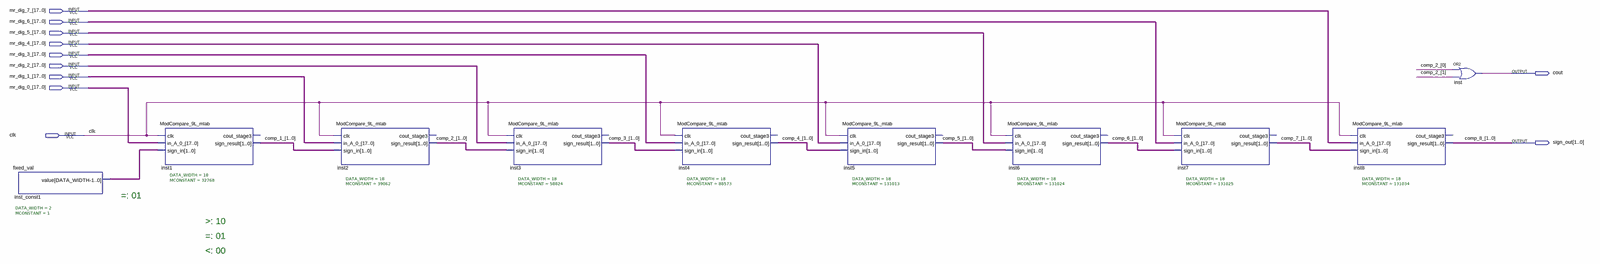
[diagram p0: schematic sheet, whole]
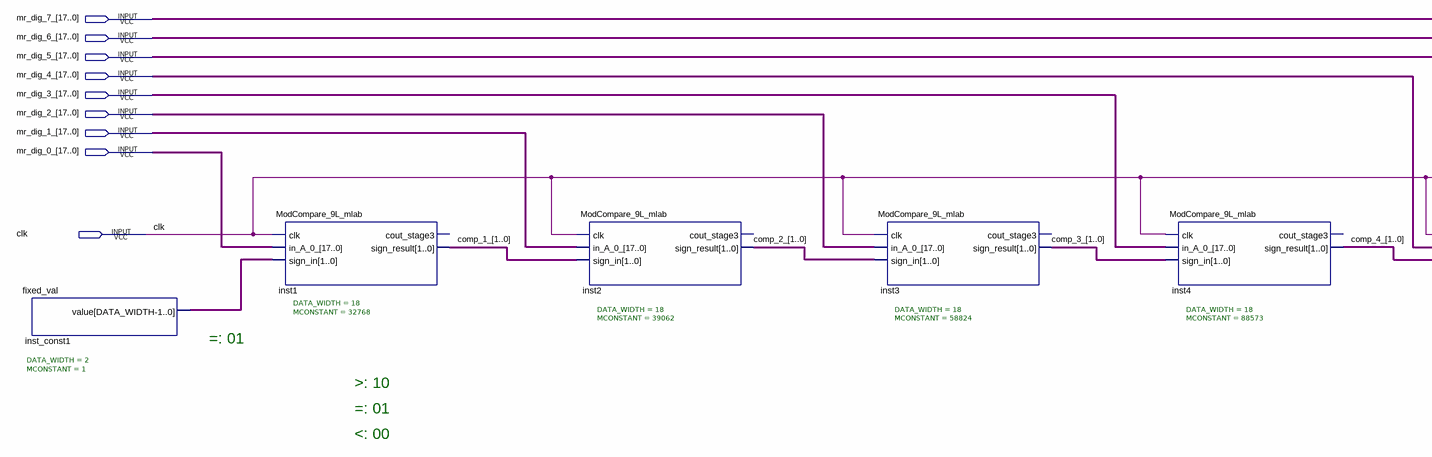
[diagram p1: schematic sheet, left part]
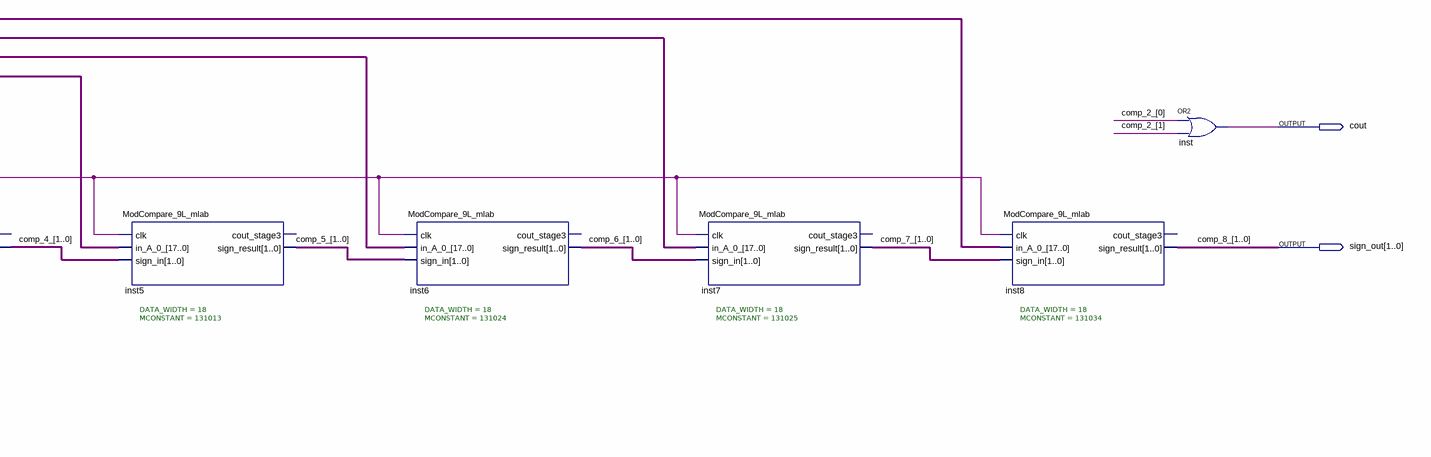
[diagram p2: schematic sheet, right part]
// Quartus schematic Compare_pipe.bdf as structural Verilog: 10 symbols, 11 pins
module Compare_pipe (
  input  [17:0] mr_dig_7_,
  input  [17:0] mr_dig_6_,
  input  [17:0] mr_dig_5_,
  input  [17:0] mr_dig_4_,
  input  [17:0] mr_dig_3_,
  input  [17:0] mr_dig_2_,
  input  [17:0] mr_dig_1_,
  input  [17:0] mr_dig_0_,
  input  clk,
  output cout,
  output [1:0] sign_out
);

  wire [1:0] comp_1_, comp_2_, comp_3_, comp_4_, comp_5_, comp_6_, comp_7_, inst_const1_value;

  fixed_val #(.DATA_WIDTH(2), .MCONSTANT(1)) inst_const1 (.value(inst_const1_value));
  ModCompare_9L_mlab #(.DATA_WIDTH(18), .MCONSTANT(32768)) inst1 (
    .clk(clk), .in_A_0_(mr_dig_0_), .sign_in(inst_const1_value), .sign_result(comp_1_));  // open: cout_stage3
  ModCompare_9L_mlab #(.DATA_WIDTH(18), .MCONSTANT(39062)) inst2 (
    .clk(clk), .in_A_0_(mr_dig_1_), .sign_in(comp_1_), .sign_result(comp_2_));  // open: cout_stage3
  ModCompare_9L_mlab #(.DATA_WIDTH(18), .MCONSTANT(58824)) inst3 (
    .clk(clk), .in_A_0_(mr_dig_2_), .sign_in(comp_2_), .sign_result(comp_3_));  // open: cout_stage3
  ModCompare_9L_mlab #(.DATA_WIDTH(18), .MCONSTANT(88573)) inst4 (
    .clk(clk), .in_A_0_(mr_dig_3_), .sign_in(comp_3_), .sign_result(comp_4_));  // open: cout_stage3
  ModCompare_9L_mlab #(.DATA_WIDTH(18), .MCONSTANT(131013)) inst5 (
    .clk(clk), .in_A_0_(mr_dig_4_), .sign_in(comp_4_), .sign_result(comp_5_));  // open: cout_stage3
  ModCompare_9L_mlab #(.DATA_WIDTH(18), .MCONSTANT(131024)) inst6 (
    .clk(clk), .in_A_0_(mr_dig_5_), .sign_in(comp_5_), .sign_result(comp_6_));  // open: cout_stage3
  ModCompare_9L_mlab #(.DATA_WIDTH(18), .MCONSTANT(131025)) inst7 (
    .clk(clk), .in_A_0_(mr_dig_6_), .sign_in(comp_6_), .sign_result(comp_7_));  // open: cout_stage3
  ModCompare_9L_mlab #(.DATA_WIDTH(18), .MCONSTANT(131034)) inst8 (
    .clk(clk), .in_A_0_(mr_dig_7_), .sign_in(comp_7_), .sign_result(sign_out));  // open: cout_stage3
  or inst (cout, comp_2_[0], comp_2_[1]);

  // Other names for the same wires on the sheet: comp_8_[1:0] = sign_out

  // Notes on the sheet:
  //   =: 01
  //   >: 10
  //   =: 01
  //   <: 00
endmodule
